# Altium schematic sheet SCH Uno-CellTap.SchDoc: Arduino BMS - Balancer Taps
size Letter; Organization: Adv Power Electronics Lab; Address1: Kettering University; Address2: 1700 University Ave; Address3: Flint, MI 48504; Address4: United States of America; DocumentNumber: 2; SheetNumber: 2; SheetTotal: 2
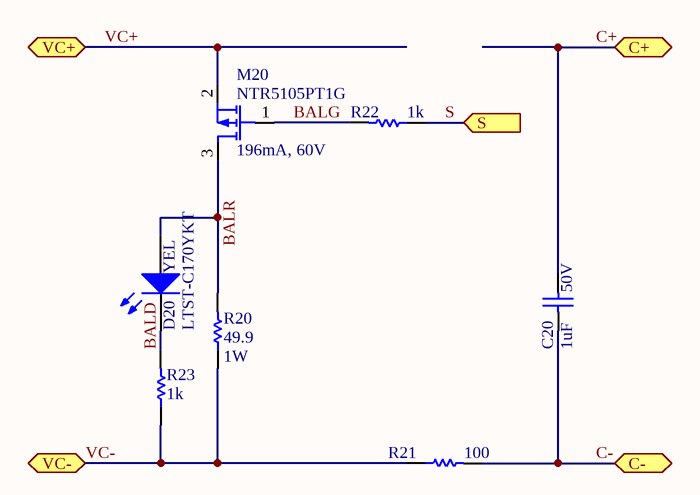
[diagram p0: SCH Uno-CellTap.SchDoc]

## Parts
C20  value 1uF  Rated: 50V  [CAPC2012N]  (hidden comment: CL21F105ZBFNNNE)
D20  LTST-C170YKT  value YEL  [DIO2012N-Y]
M20  NTR5105PT1G  Rated: 196mA, 60V  [SOT23-3N]
R20  value 49.9  Rated: 1W  [RESC6432N]  (hidden comment: RMCF2512FT49R9)
R21  value 100  [RESC2012N]  (hidden comment: ERJ-6ENF1000V)
R22  value 1k  [RESC2012N]  (hidden comment: ERJ-6ENF1001V)
R23  value 1k  [RESC2012N]  (hidden comment: ERJ-6ENF1001V)

## Ports
C+ (bidir), C- (bidir), S (in), VC+ (bidir), VC- (bidir)

## Nets
BALD: D20.2(K) R23.2
BALG: M20.1(G) R22.2
BALR: D20.1(A) M20.3(D) R20.2
C+: C20.1 ; port C+
C-: C20.2 R21.2 ; port C-
S: R22.1 ; port S
VC+: M20.2(S) ; port VC+
VC-: R20.1 R21.1 R23.1 ; port VC-

## Notes on the sheet
- Title
- Size:
- Date:
- Letter
- Number:
- Time:
- Revision:
- Sheet
- of
- File:

## Library data of the parts
C20 = Cap: Capacitor; Tol: 20%; Temp: 85C; Supplier 1: Digi-Key; Supplier Part Number 1: 1276-3010-1-ND; Category: C
D20 = LTST-C170YKT: SMT Yellow Si LED; Rated: 10mA, 6mcd; Category: D; Supplier 1: Digi-Key; Supplier Part Number 1: 160-1175-1-ND
M20 = MOSFET-P: P-Channel MOSFET; Value: 5 Ohm; Category: M; ComponentLink1Description: &Datasheet; ComponentLink1URL: http://www.onsemi.com/pub/Collateral/NTR5105P-D.PDF; Supplier 1: Digi-Key; Supplier Part Number 1: NTR5105PT1GOSCT-ND
R20 = Res1: Resistor, 1W; Tol: 1%; Category: R; Supplier 1: Digi-Key; Supplier Part Number 1: RMCF2512FT49R9CT-ND
R21-R23 = Res1: Resistor; Rated: 1/8W; Tol: 1%; Supplier 1: Digi-Key; Category: R
  R21: Supplier Part Number 1: P100CCT-ND
  R22 R23: Supplier Part Number 1: P1.00KCCT-ND